# Altium schematic sheet Amplified Modulator.schdoc: Amplified Modulator
size A4; Organization: Altium Limited; Address1: L3, 12a Rodborough Rd; Address2: Frenchs Forest; Address3: NSW; Address4: Australia 2086; DocumentNumber: 1; SheetNumber: 1; SheetTotal: 3
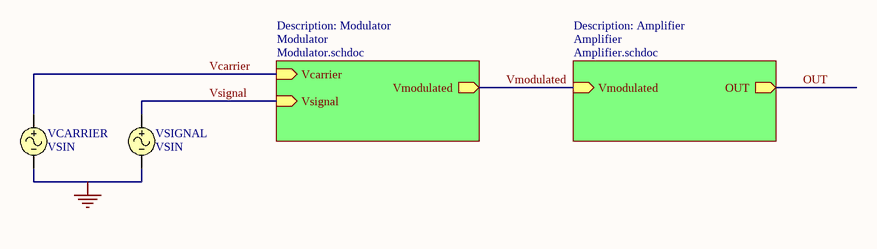
[diagram p0: Amplified Modulator.schdoc]

## Parts
VCARRIER  VSIN
VSIGNAL  VSIN

## Sub-sheets
Amplifier = Amplifier.schdoc: Vmodulated (in), OUT (out)  | Description: Amplifier
Modulator = Modulator.schdoc: Vmodulated (out), Vcarrier (in), Vsignal (in)  | Description: Modulator

## Nets
GND: VCARRIER.2 VSIGNAL.2
OUT: sheet Amplifier/OUT
Vcarrier: VCARRIER.1 ; sheet Modulator/Vcarrier
Vmodulated: sheet Amplifier/Vmodulated, sheet Modulator/Vmodulated
Vsignal: VSIGNAL.1 ; sheet Modulator/Vsignal

## Notes on the sheet
- Title
- Size:
- Date:
- A4
- Number:
- Time:
- Revision:
- Sheet
- of
- File:

## Library data of the parts
VCARRIER VSIGNAL = VSIN: Sinusoidal Voltage Source